# Altium schematic sheet GeneratedSystem-03.SchDoc
size 101 x 101 mm
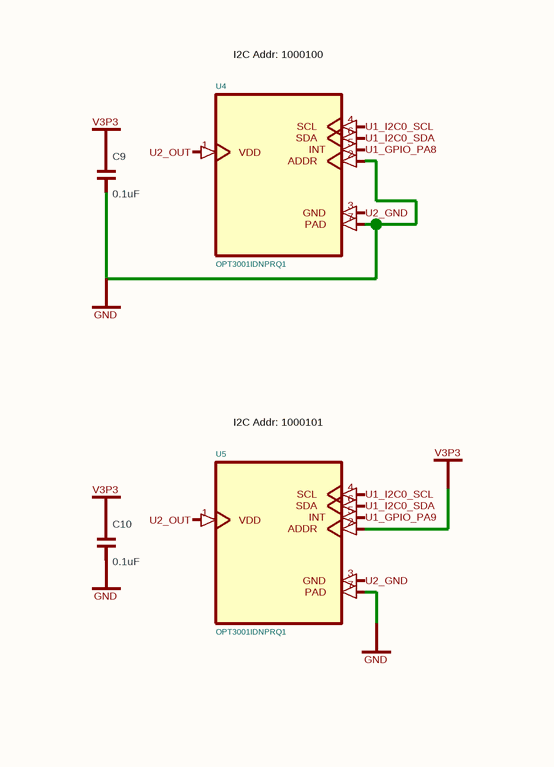
[diagram p0: GeneratedSystem-03.SchDoc]

## Parts
C9  0.1uF
C10  0.1uF
U4  (no value)
U5  (no value)

## Nets
GND: C9.2(cathode) C10.2(cathode) U4.2(ADDR) U4.7(PAD) U5.7(PAD)
V3P3: C9.1(anode) C10.1(anode) U5.2(ADDR)
U1_GPIO_PA8: U4.5(INT)
U1_GPIO_PA9: U5.5(INT)
U1_I2C0_SCL: U4.4(SCL) U5.4(SCL)
U1_I2C0_SDA: U4.6(SDA) U5.6(SDA)
U2_GND: U4.3(GND) U5.3(GND)
U2_OUT: U4.1(VDD) U5.1(VDD)

## Notes on the sheet
- (near U4) I2C Addr: 1000100
- (near U5) I2C Addr: 1000101
- (in symbol U4) OPT3001IDNPRQ1
- (in symbol U5) OPT3001IDNPRQ1

## Library data of the parts
C9 C10 = capacitor_down
U4 = U4
U5 = U5